# Altium schematic sheet FPGA_51_Morse.SchDoc
size A; Organization: Altium Limited; Address1: L3, 12a Rodborough Rd; Address2: Frenchs Forest; Address3: NSW; Address4: Australia 2086; DocumentNumber: 1; SheetNumber: 1; SheetTotal: 2
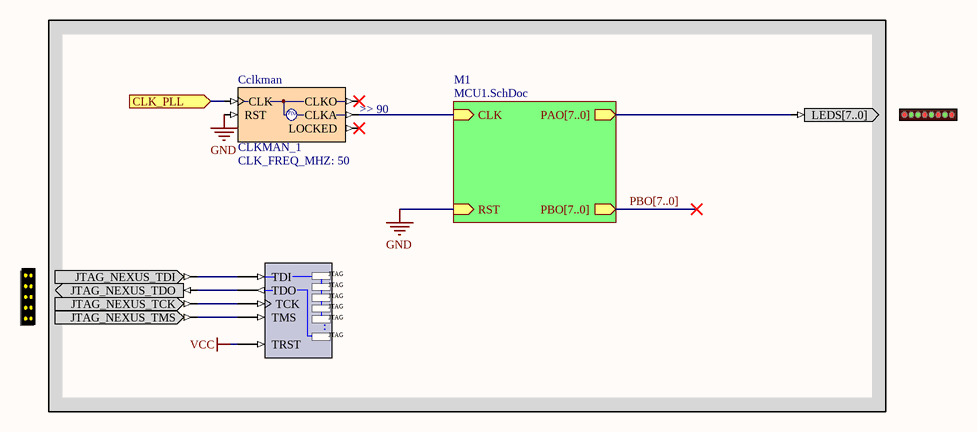
[diagram p0: FPGA_51_Morse.SchDoc]

## Parts
(Parts that share a designator on the sheet are numbered #1, #2 ... from top to bottom, then left to right.)
?#1  LED  (value not drawn)
?#2  NEXUS_JTAG_CONNECTOR  (value not drawn)
Cclkman  CLKMAN_1  CLK_FREQ_MHZ: 50  ClkA_Operation: >> 90
NEXUS_JTAG_PORT  NEXUS_JTAG_PORT  (value not drawn)

## Sub-sheets
M1 = MCU1.SchDoc: CLK (in), RST (in), PAO[7..0] (out), PBO[7..0] (out)

## Ports
CLK_PLL (in)

## Nets
GND: Cclkman.RST ; sheet M1/RST
VCC: NEXUS_JTAG_PORT.TRST
CLK_PLL: Cclkman.CLK ; port CLK_PLL
Net?#1_LEDS[7..0]: ?#1.LEDS[7..0] ; sheet M1/PAO[7..0]
Net?#2_JTAG_NEXUS_TCK: ?#2.JTAG_NEXUS_TCK NEXUS_JTAG_PORT.TCK
Net?#2_JTAG_NEXUS_TDI: ?#2.JTAG_NEXUS_TDI NEXUS_JTAG_PORT.TDI
Net?#2_JTAG_NEXUS_TDO: ?#2.JTAG_NEXUS_TDO NEXUS_JTAG_PORT.TDO
Net?#2_JTAG_NEXUS_TMS: ?#2.JTAG_NEXUS_TMS NEXUS_JTAG_PORT.TMS
NetCclkman_CLKA: Cclkman.CLKA ; sheet M1/CLK

Not connected (* = marked no-connect by the designer): Cclkman CLKO* LOCKED*

## Buses and harness runs
bus PBO[7..0] = sheet M1/PBO[7..0]

## Notes on the sheet
- Title
- Size:
- Date:
- A
- Number:
- Time:
- Revision:
- Sheet
- of
- File:
- (in symbol CLKMAN_1) F(x)
- (in symbol NEXUS_JTAG_PORT) JTAG; .

## Library data of the parts
?#1 = LED: 8-Way LEDS; PortComponent: True; Published: 19-Nov-2003; Publisher: Altium Limited
?#2 = NEXUS_JTAG_CONNECTOR: JTAG Port; PortComponent: True; Published: 19-Nov-2003; Publisher: Altium Limited
Cclkman = CLKMAN_1: Single Operational Output Clock Manager; Clk_Count: 1; Published: 5-Jul-2004; Publisher: Altium Limited; LastRevisionNo: 1.00.00; Nexus_Core: ClockManager; HelpURL: CR0118 FPGA Generic Library Guide.pdf#page=149; ComponentLink1URL: CR0128 FPGA Clock Manager Resource Usage.pdf#page=2; ComponentLink1Description: Core &Resource Usage; FunctionalClass: Clock Manager; PortSize: 1
NEXUS_JTAG_PORT = NEXUS_JTAG_PORT: Soft Nexus-Chain Connector; NEXUS_JTAG_CONNECTOR: True; Published: 18-Dec-2003; Publisher: Altium Limited